# EAGLE design PICO V1.0 (EAGLE 9.6.2)
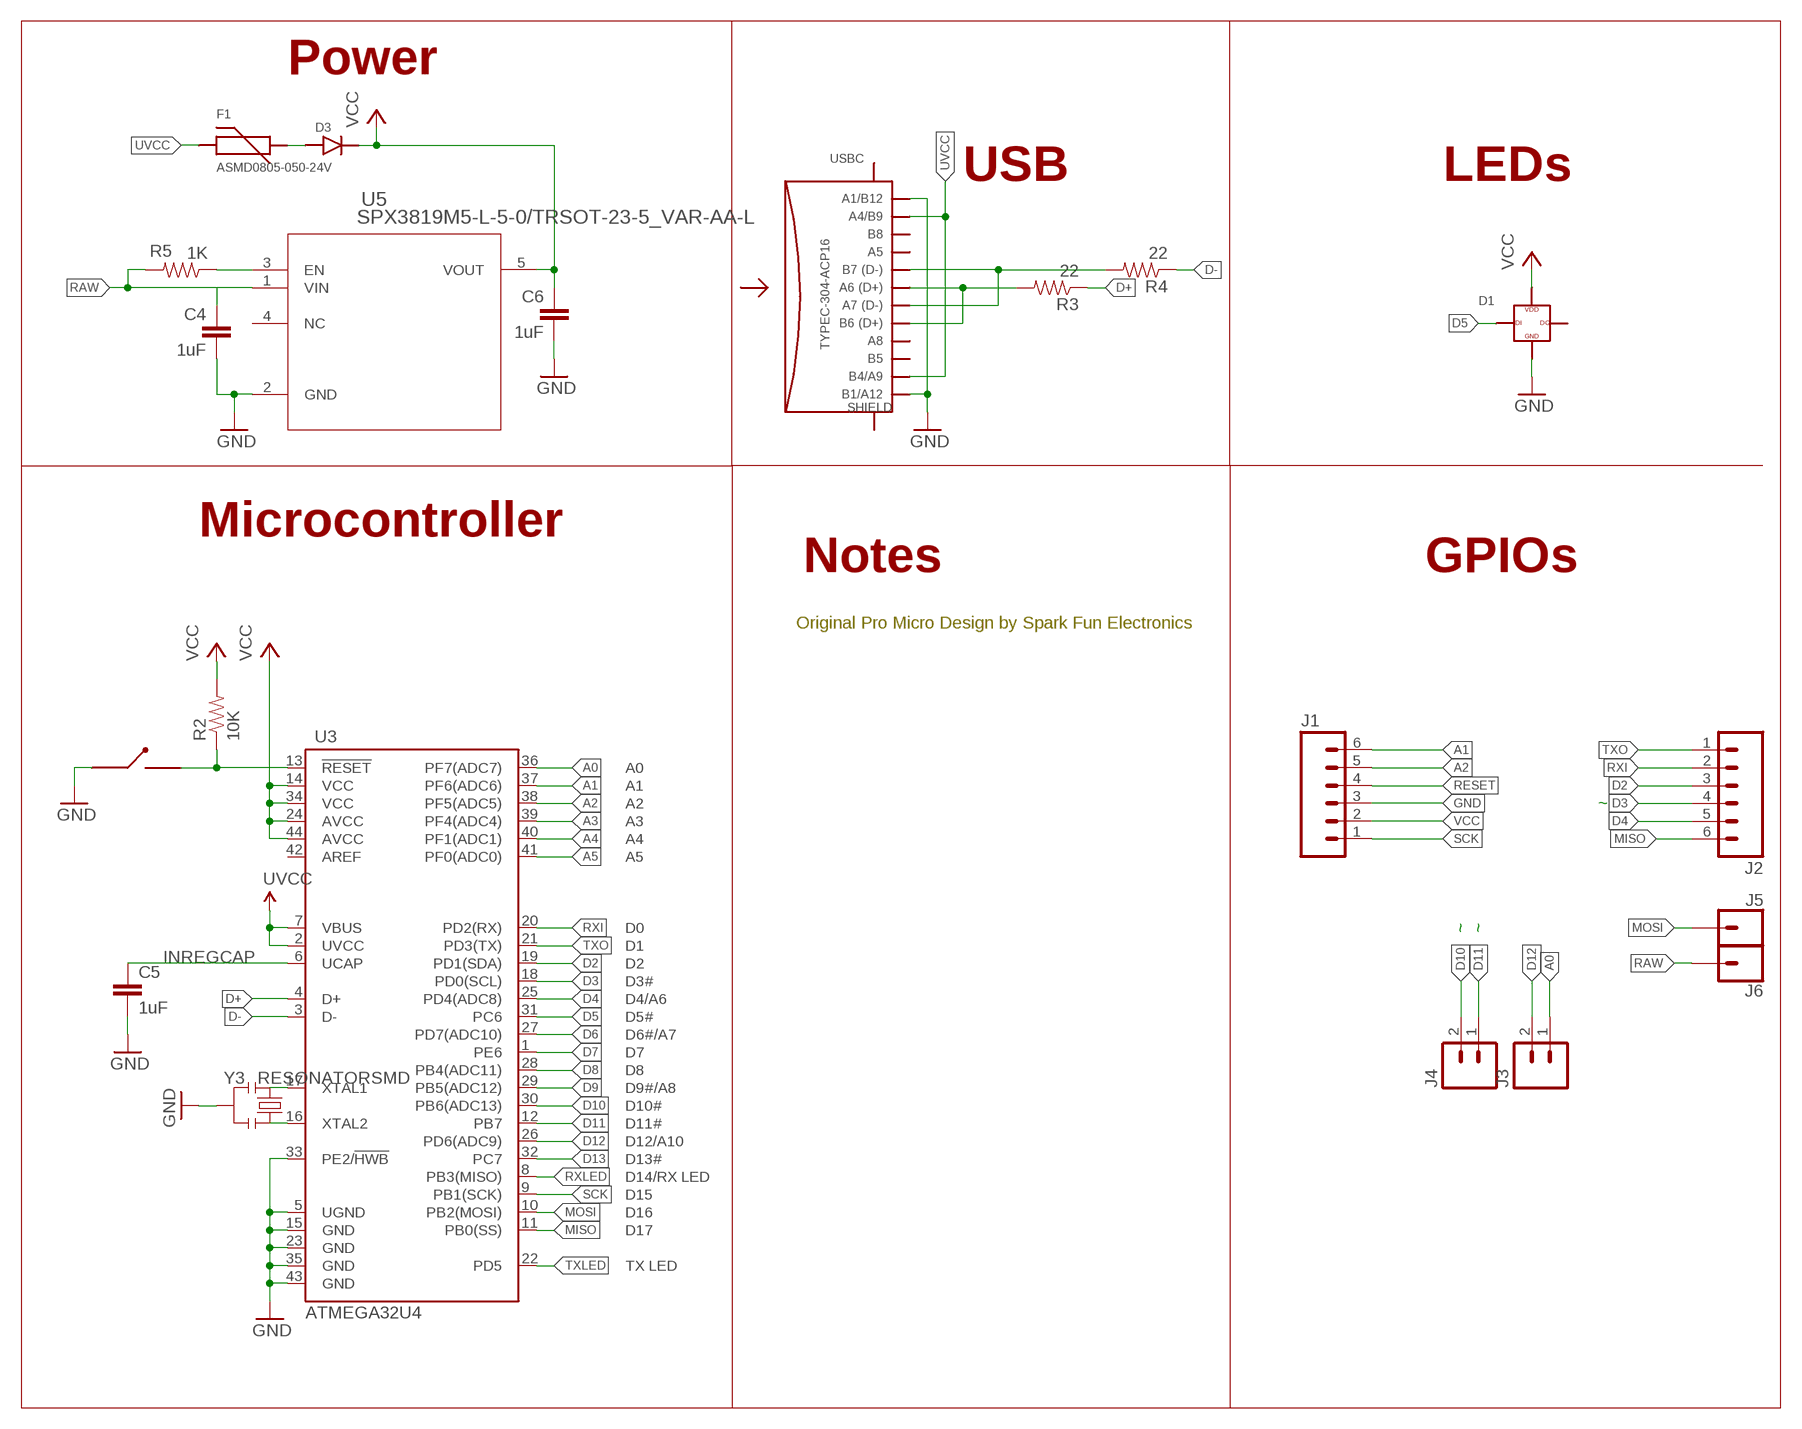
[diagram p0: schematic, sheet 1]

## Parts
C4  1uF  CAP0402-CAP  [0402-CAP]
C5  1uF  CAP0402-CAP  [0402-CAP]
C6  1uF  CAP0402-CAP  [0402-CAP]
D1  XL-1010RGBC-WS2812B  [XL-1010RGBC-WS2812B]
D3  1N4148W-TP  [1N4148W-TP]
F1  ASMD0805-050-24V  [ASMD0805-050-24V]
J1  M06SILK_FEMALE_PTH  [1X06]
J2  M06SILK_FEMALE_PTH  [1X06]
J3  M02PTH  [1X02]
J4  M02PTH  [1X02]
J5  CONN_01  [1X01]
J6  CONN_01  [1X01]
R2  10K  RESISTOR0402  [0402-RES]
R3  22  RESISTOR0402  [0402-RES]
R4  22  RESISTOR0402  [0402-RES]
R5  1K  RESISTOR0402  [0402-RES]
S1  B3U-1000P  [B3U-1000P]
U3  ATMEGA32U4  ATMEGA32U4OUTFAKES  [QFN-44-NOPAD_1:1-OUTFAKES]
U5  SPX3819M5-L-5-0/TRSOT-23-5_VAR-AA-L  [TPSPX3819M5-L-5-0/3]
USBC  TYPEC-304-ACP16  [TYPEC-304-ACP16]
Y3  RESONATORSMD  [RESONATOR-SMD]

## Nets
A0: J3.1 U3.36(PF7(ADC7))
A1: J1.6 U3.37(PF6(ADC6))
A2: J1.5 U3.38(PF5(ADC5))
A3: U3.39(PF4(ADC4))
A4: U3.40(PF1(ADC1))
A5: U3.41(PF0(ADC0))
D2: J2.3 U3.19(PD1(SDA))
D3: J2.4 U3.18(PD0(SCL))
D4: J2.5 U3.25(PD4(ADC8))
D5: D1.4 U3.31(PC6)
D6: U3.27(PD7(ADC10))
D7: U3.1(PE6)
D8: U3.28(PB4(ADC11))
D9: U3.29(PB5(ADC12))
D10: J4.2 U3.30(PB6(ADC13))
D11: J4.1 U3.12(PB7)
D12: J3.2 U3.26(PD6(ADC9))
D13: U3.32(PC7)
D+: R3.1 U3.4(D+)
D-: R4.1 U3.3(D-)
GND [vcc]: C4.2 C5.2 C6.2 D1.3 J1.3 S1.1 U3.5(UGND) U3.15(GND) U3.23(GND) U3.33(PE2/!HWB) U3.35(GND) U3.43(GND) U5.2(GND) USBC.A1/B12 USBC.B1/A12 Y3.2
INREGCAP: C5.1 U3.6(UCAP)
MISO: J2.6 U3.11(PB0(SS))
MOSI: J5.1 U3.10(PB2(MOSI))
N$1: U3.16(XTAL2) Y3.3
N$2: U3.17(XTAL1) Y3.1
N$4: R5.1 U5.3(EN)
N$5: D3.1 F1.2
N$7: R3.2 USBC.A6 USBC.B6
N$9: R4.2 USBC.A7 USBC.B7
RAW [vcc]: C4.1 J6.1 R5.2 U5.1(VIN)
RESET: J1.4 R2.1 S1.2 U3.13(!RESET)
RXI: J2.2 U3.20(PD2(RX))
RXLED: U3.8(PB3(MISO))
SCK: J1.1 U3.9(PB1(SCK))
TXLED: U3.22(PD5)
TXO: J2.1 U3.21(PD3(TX))
UVCC: F1.1 U3.2(UVCC) U3.7(VBUS) USBC.A4/B9 USBC.B4/A9
VCC: C6.1 D1.2 D3.2 J1.2 R2.2 U3.14(VCC) U3.24(AVCC) U3.34(VCC) U3.44(AVCC) U5.5(VOUT)
Unconnected: D1.1 U3.42(AREF) U5.4(NC) USBC.A5 USBC.A8 USBC.B5 USBC.B8 USBC.P$1(SHIELD1) USBC.P$2(SHIELD1) USBC.P$3(SHIELD2) USBC.P$4(SHIELD2)

## Notes on the sheet
- Power
- USB | LEDs
- Microcontroller
- Notes | GPIOs
- Original Pro Micro Design by Spark Fun Electronics
- ~
- ~ | ~

## Library data of the parts
C4-C6 = SparkFun-Capacitors:CAP: Capacitor Standard 0603 ceramic capacitor, and 0.1" leaded capacitor.
D1 = XL-1010RGBC-WS2812B:XL-1010RGBC-WS2812B
D3 = 1N4148W-TP:1N4148W-TP
F1 = ASMD0805-050-24V:ASMD0805-050-24V
J1 J2 = SparkFun-Connectors:M06: Header 6 Standard 6-pin 0.1" header. Use with straight break away headers (SKU : PRT-00116), right angle break away headers (PRT-00553), swiss pins (PRT-00743), machine pins (PRT-00117), and female headers (PRT-00115). Molex polarized connector foot print use with SKU : PRT-08094 with associated crimp pins and housings. NOTES ON THE VARIANTS LOCK and LOCK_LONGPADS... This footprint was designed to help hold the alignment of a through-hole component (i.e. 6-pin header) while soldering it into place. You may notice that each hole has been shifted either up or down by 0.005 of an inch from it's more standard position (which is a perfectly straight line). This slight alteration caused the pins (the squares in the middle) to touch the edges of the holes. Because they are alternating, it causes a "brace" to hold the component in place. 0.005 has proven to be the perfect amount of "off-center" position when using our standard breakaway headers. Although looks a little odd when you look at the bare footprint, once you have a header in there, the alteration is very hard to notice. Also,if you push a header all the way into place, it is covered up entirely on the bottom side. This idea of altering the position of holes to aid alignment will be further integrated into the Sparkfun Library for other footprints. It can help hold any component with 3 or more connection pins.; PROD_ID: CONN-08437
J3 J4 = SparkFun-Connectors:M02: Standard 2-pin 0.1" header. Use with - straight break away headers ( PRT-00116) - right angle break away headers (PRT-00553) - swiss pins (PRT-00743) - machine pins (PRT-00117) - female headers (PRT-00115) Molex polarized connector foot print use with: PRT-08233 with associated crimp pins and housings. 2.54_SCREWTERM for use with PRT-10571. 3.5mm Screw Terminal footprints for PRT-08084 5mm Screw Terminal footprints for use with PRT-08432
J5 J6 = SparkFun-Connectors:CONN_01: Single connection point. Often used as Generic Header-pin footprint for 0.1 inch spaced/style header connections On any of the 0.1 inch spaced packages, you can populate with these: Break Away Headers - Straight <https://www.sparkfun.com/products/116> (PRT-00116) Break Away Male Headers - Right Angle <https://www.sparkfun.com/products/553> (PRT-00553) Female Headers <https://www.sparkfun.com/products/115> (PRT-00115) Break Away Headers - Machine Pin <https://www.sparkfun.com/products/117> (PRT-00117) Break Away Female Headers - Swiss Machine Pin <https://www.sparkfun.com/products/743> (PRT-00743) This device is also useful as a general connection point to wire up your design to another part of your project. Our various solder wires solder well into these plated through hole pads. Hook-Up Wire - Assortment (Stranded, 22 AWG) <https://www.sparkfun.com/products/11375> (PRT-11375) Hook-Up Wire - Assortment (Solid Core, 22 AWG) <https://www.sparkfun.com/products/11367> (PRT-11367) View the entire wire category on our website here <https://www.sparkfun.com/categories/141> Special notes: SMTSO-256-ET is a "flush mount" nut for a 4-40 screw. We mostly use this on specialty testbeds; it is a nice way to connect hardware to your PCB at an adjustable hieght. Also note, the SNAP packages are for using a snappable style connector. We sell a baggie of snaps and they are also used on two LilyPad designs: Snap Assortment - 30 pack (male and female) <https://www.sparkfun.com/products/11347> (DEV-11347) LilyPad Arduino SimpleSnap <https://www.sparkfun.com/products/10941> (DEV-10941) LilyPad SimpleSnap Protoboard <https://www.sparkfun.com/products/10940> (DEV-10940)
R2-R5 = SparkFun-Resistors:RESISTOR: Resistor Basic schematic elements and footprints for 0603, 1206, and PTH resistors.
S1 = B3U-1000P:B3U-1000P
U3 = Testing:ATMEGA32U4: Atmel 44-pin 8-bit Microcontroller with 32KBytes of ISP Flash and USB Controller
U5 = TPSPX3819M5-L-5-0:SPX3819M5-L-5-0/TR; COPYRIGHT: Copyright (C) 2024 Ultra Librarian. All rights reserved.; MANUFACTURER_PART_NUMBER: SPX3819M5-L-5-0/TR; MFR_NAME: MaxLinear
USBC = TYPEC-304-ACP16:TYPEC-304-ACP16
Y3 = SparkFun:RESONATOR: Resonator Small SMD resonator. This is the itty bitty 10/20MHz resonators with built in caps. CSTCE10M0G55 and CSTCE20M0V53. Footprint has been reviewed closely but hasn't been tested yet.

## Net classes
0 default: width 0.152 mm, drill 0.15 mm, clearance 0.152 mm

## Board
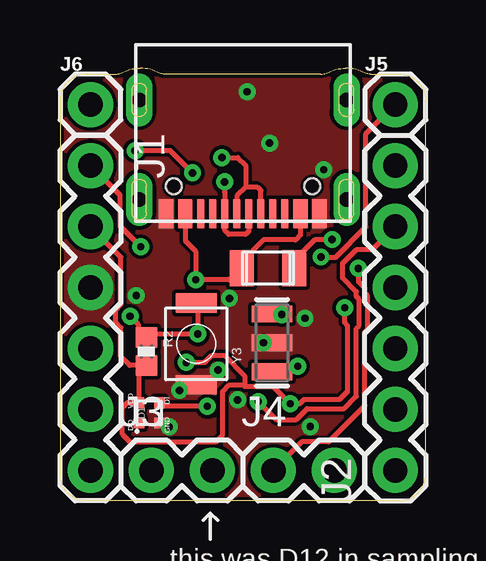
[diagram p1: board, top side]
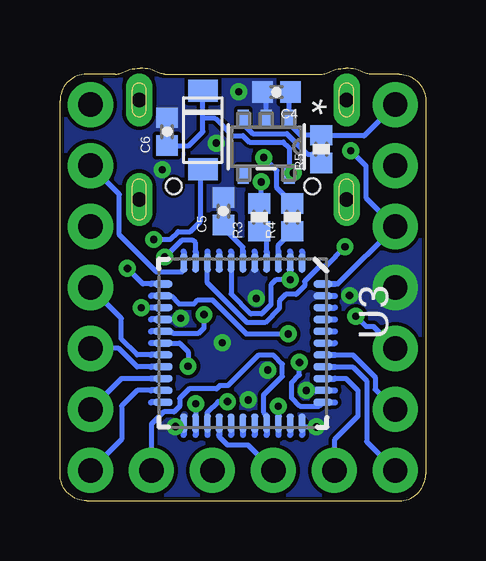
[diagram p2: board, bottom side, seen from below]

Size 15.24 x 18.02 mm. Coordinates in mm from the lower left corner, seen from the top.
Outline: 14.13,17.78 arc-90 15.24,16.67 15.24,1.11 arc-90 14.13,0 1.11,0 arc-90 0,1.11 0,16.67 arc-90 1.11,17.78 2.3,17.78 arc28 2.62,17.86 arc-31 3.33,18.02 arc-31 4.05,17.86 arc28 4.37,17.78 10.87,17.78 arc28 11.19,17.86 arc-31 11.91,18.02 arc-31 12.62,17.86 arc28 12.94,17.78 14.13,17.78
Copper layers (1*16): Top 0.035mm / dielectric 1.5mm / Bottom 0.035mm
Design rules "default *": minimum track width 8mil, minimum drill 0.3mm, track to track 6mil, track to pad 6mil, pad to pad 6mil, via to via 6mil, smd to smd 6mil, copper to edge 6mil, drill to drill 6mil, minimum pad ring 10mil, minimum via ring 8mil, stop-mask expansion 0mil, vias tented up to drill 12mil, thermal gap 10mil

### Footprints (pad centres in the part's own frame; a part is rotated, then mirrored left to right if it is on the bottom)
0402-CAP = smd 0.85 x 0.9: 1 -0.58,0; 2 0.58,0
XL-1010RGBC-WS2812B = smd 0.45 x 0.45: 1 -0.425,0.425; 2 0.425,0.425; 3 -0.425,-0.425; 4 0.425,-0.425
1N4148W-TP = smd 0.91 x 1.22: 1 -1.635,0; 2 1.635,0
ASMD0805-050-24V = smd 1 x 1.5: 1 -1.1,0; 2 1.1,0
1X06 = drill 1.016 pad 1.88: 1 0,0; 2 2.54,0; 3 5.08,0; 4 7.62,0; 5 10.16,0; 6 12.7,0
1X02 = drill 1.016 pad 1.88: 1 0,0; 2 2.54,0
1X01 = drill 1.016 pad 1.88: 1 0,0
0402-RES = smd 0.85 x 0.9: 1 -0.58,0; 2 0.58,0
B3U-1000P = smd 0.8 x 1.7: 1 1.7,0; 2 -1.7,0
QFN-44-NOPAD_1:1-OUTFAKES = smd 0.8 x 0.3: 1 -3.337,2.465; 2 -3.337,1.972; 3 -3.337,1.479; 4 -3.337,0.986; 5 -3.337,0.493; 6 -3.337,0; 7 -3.337,-0.493; 8 -3.337,-0.986; 9 -3.337,-1.479; 10 -3.337,-1.972; 11 -3.337,-2.465; 23 3.337,-2.465; 24 3.337,-1.972; 25 3.337,-1.479; 26 3.337,-0.986; 27 3.337,-0.493; 28 3.337,0; 29 3.337,0.493; 30 3.337,0.986; 31 3.337,1.479; 32 3.337,1.972; 33 3.337,2.465 | smd 0.3 x 0.8: 12 -2.465,-3.337; 13 -1.972,-3.337; 14 -1.479,-3.337; 15 -0.986,-3.337; 16 -0.493,-3.337; 17 0,-3.337; 18 0.493,-3.337; 19 0.986,-3.337; 20 1.479,-3.337; 21 1.972,-3.337; 22 2.465,-3.337; 34 2.465,3.337; 35 1.972,3.337; 36 1.479,3.337; 37 0.986,3.337; 38 0.493,3.337; 39 0,3.337; 40 -0.493,3.337; 41 -0.986,3.337; 42 -1.479,3.337; 43 -1.972,3.337; 44 -2.465,3.337
TPSPX3819M5-L-5-0/3 = smd 0.747 x 0.458: 1 -1.174,0.95; 2 -1.174,0; 3 -1.174,-0.95; 4 1.174,-0.95; 5 1.174,0.95
TYPEC-304-ACP16 = smd 0.6 x 1.2: A1/B12 -3.2,3.375; A4/B9 -2.4,3.375; B1/A12 3.2,3.375; B4/A9 2.4,3.375 | smd 0.3 x 1.2: A5 -1.25,3.375; A6 -0.25,3.375; A7 0.25,3.375; A8 1.25,3.375; B5 1.75,3.375; B6 0.75,3.375; B7 -0.75,3.375; B8 -1.75,3.375 | drill 0.6 pad 1.05 long: P$1 -4.32,2.775; P$2 4.32,2.775 | drill 0.6 pad 0.95 long: P$3 -4.32,-1.375; P$4 4.32,-1.375 | hole 0.65: -2.89,2.225; 2.89,2.225
RESONATOR-SMD = smd 0.7 x 1.7: 1 -1.2,0; 2 0,0; 3 1.2,0

### Placement (x,y rotation side)
C4  6.22,17.03 180 bottom
C5  8.43,12.07 90 bottom
C6  10.78,15.38 90 bottom
D1  3.72,3.67 90 top
D3  9.29,15.45 90 bottom
F1  8.67,9.7 0 top
J1  1.27,13.97 270 top
J2  13.97,1.27 90 top
J3  3.81,1.27 0 top
J4  8.89,1.27 0 top
J5  13.97,16.51 0 top
J6  1.27,16.51 0 top
R2  3.6,6.22 270 top
R3  6.94,11.81 90 bottom
R4  5.56,11.81 90 bottom
R5  4.35,14.65 90 bottom
S1  5.68,6.54 270 top
U3  7.62,6.57 270 bottom
U5  6.65,14.75 270 bottom
USBC  7.62,15.33 180 top
Y3  8.84,6.58 90 top

### Tracks (layer width: path | path; a pad name or v marks a point on that pad's centre or on a via)
A0
  Bottom 0.203: U3.36 3.31,5.09 2.82,4.6 2.82,3.53 3.81,2.54 J3.1
A1
  Bottom 0.203: U3.37 3.05,5.59 2.46,5 2.46,2.46 J1.6
A2
  Bottom 0.203: U3.38 3.6,6.08 3.04,6.08 2.11,5.15 2.11,4.65 J1.5
D2
  Bottom 0.203: U3.19 12.03,5.59 12.79,6.35 J2.3
D3
  Bottom 0.203: U3.18 12.02,6.08 12.68,6.74 12.68,7.6 J2.4
D4  (via drill 0.3)
  Top 0.203: v8.26,4.14 9.02,3.38 9.84,3.38 10.3,3.84 11.84,3.84 12.34,4.35 12.34,7.18 12.47,7.3 12.47,8.39 12.34,8.52 12.34,8.72 11.78,9.29 11.78,9.91 12.34,10.46 13,10.46 J2.5
  Bottom 0.203: U3.25 9.1,3.69 8.65,4.14 v8.26,4.14
D5  (via drill 0.3)
  Top 0.203: v6.14,3.94 4.3,3.94 D1.4
  Bottom 0.203: U3.31 | U3.31 v6.14,3.94
D10
  Bottom 0.203: J4.2 11.43,3.19 10.92,3.7 10.49,3.7 10.26,3.93 10.26,4.27 9.86,4.67 8.72,4.67 8.59,4.8 8.24,4.8 6.99,6.06 6.33,6.06 5.98,5.7 5.98,5.18 6.76,4.4 6.76,3.7 6.63,3.56 U3.30
D11  (via drill 0.3)
  Top 0.203: v12.43,9.68 12.43,9.14 12.7,8.87 12.7,8.66 12.82,8.54 12.82,7.16 12.7,7.04 12.7,3.97 11.19,2.46 10.08,2.46 J4.1
  Bottom 0.203: v12.43,9.68 11.78,9.04 U3.12
D12
  Bottom 0.203: U3.26 8.61,2.67 8.27,2.33 7.41,2.33 J3.2
D+
  Bottom 0.203: U3.4 6.63,10.93 R3.1
D-
  Bottom 0.203: U3.3 6.14,10.65 R4.1
GND  (via drill 0.3)
  Top 0.203: Y3.2 v8.48,6.58 v8.48,6.59 | D1.3 4.39,3.24 v4.56,3.08
  Bottom 0.203: U5.2 6.64,16.87 C4.2 | U3.23 10.29,3.24 v10.43,3.1 | U3.33 5.16,3.08 v4.56,3.08
  other vias: 10.21,7.6 6.59,5.45 10.99,13.8 8.73,14.91 7.79,17.05 3.17,8.56 7.06,8.44 7.4,4.2 4.98,4.6
  pour Bottom (no thermals): 1.11,17.78 14.13,17.78 arc-90 15.24,16.67 15.24,1.11 arc-90 14.13,0 1.11,0 arc-90 0,1.11 0,16.67 arc-90
  pour Top (no thermals): 1.11,17.78 14.13,17.78 arc-90 15.24,16.67 15.24,1.11 arc-90 14.13,0 1.11,0 arc-90 0,1.11 0,16.67 arc-90
INREGCAP
  Bottom 0.203: U3.6 7.62,10.57 8.43,11.38 C5.1
MISO
  Bottom 0.203: U3.11 10.09,9.62 10.16,9.54 11.23,9.54 12.77,11.09 12.77,12.77 J2.6
MOSI  (via drill 0.3)
  Top 0.203: v10.87,10.16 11.49,10.16 12.75,11.41 12.75,15.29 J5.1
  Bottom 0.203: U3.10 9.59,10.75 9.7,10.86 10.18,10.86 v10.87,10.16
N$1  (via drill 0.3)
  Top 0.203: Y3.3 8.86,7.76 v9.24,7.76
  Bottom 0.203: U3.16 10.62,7.07 10.54,6.99 9.46,6.99 9.24,7.21 v9.24,7.76
N$2  (via drill 0.3)
  Top 0.203: Y3.1 9.05,5.6 v9.91,5.6
  Bottom 0.203: U3.17 10.26,6.57 9.91,6.22 v9.91,5.6
N$4
  Bottom 0.203: U5.3 7.59,15.69 7.2,15.3 5.79,15.3 4.93,14.45 4.73,14.45 R5.1
N$5  (via drill 0.3)
  Top 0.203: F1.2 9.91,9.85 9.91,10.16 10.64,10.89 v11.34,10.89
  Bottom 0.203: v11.34,10.89 10.65,10.89 10.32,11.21 9.82,11.21 9.38,11.65 9.38,13.72 D3.1
N$7  (via drill 0.3)
  Top 0.203: USBC.A6 7.87,11.24 7.73,11.1 7.03,11.1 6.87,11.26 USBC.B6 6.87,12.85 6.86,12.86 v6.86,13.29
  Bottom 0.203: R3.2 6.86,12.47 v6.86,13.29
N$9  (via drill 0.3)
  Top 0.203: USBC.B7 8.37,12.93 8.24,13.06 7.73,13.06 | USBC.A7 7.37,12.7 7.73,13.06 | v6.75,14.3 7.41,14.3 7.73,13.99 7.73,13.06
  Bottom 0.203: R4.2 6.21,13.04 6.21,13.76 v6.75,14.3
RAW
  Bottom 0.203: J6.1 2.57,15.21 4.33,15.21 R5.2 5.21,15.23 5.7,15.71 U5.1 5.7,16.98 C4.1
RESET  (via drill 0.3)
  Top 0.203: S1.2 5.74,8.19 v5.74,6.96 3.75,6.96 R2.1 3.53,6.8 3.26,7.07 3.26,7.36 v2.92,7.7
  Bottom 0.203: v5.74,6.96 7.48,6.96 8.89,8.37 9.49,8.37 9.65,8.21 10.28,8.21 10.62,8.54 U3.13 | v2.92,7.7 2.49,7.26 2.19,7.26 J1.4
RXI
  Bottom 0.203: U3.20 12.69,5.09 J2.2
SCK  (via drill 0.3)
  Top 0.203: J1.1 2.49,12.75 2.49,11.46 v3.37,10.59
  Bottom 0.203: v3.37,10.59 4.17,9.78 4.42,9.78 5.04,9.15 5.04,8.96 5.4,8.6 5.83,8.6 6.1,8.33 6.1,8.03 6.7,7.43 7.13,7.43 7.45,7.43 9.1,9.08 U3.9
TXO
  Bottom 0.203: U3.21 12.02,4.6 12.67,3.95 12.67,2.57 J2.1
UVCC  (via drill 0.3)
  Top 0.203: USBC.A4/B9 10.02,11.08 9.81,10.88 8.48,10.88 7.57,9.97 F1.1 7.07,9.21 v5.65,9.21 5.65,10.4 5.22,10.83 USBC.B4/A9
  Bottom 0.203: U3.2 v5.65,9.21 6.25,9.21 6.46,9 6.46,8.17 6.83,7.79 7.29,7.79 8.11,8.62 U3.7
VCC  (via drill 0.3)
  Top 0.203: J1.2 2.54,10.16 2.54,8.17 2.31,7.95 2.31,7.45 2.54,7.22 2.54,6 2.9,5.64 R2.2 3.29,5.33 D1.2 2.81,4.09 2.6,3.89 2.6,2.78 2.91,2.47 6.51,2.47 6.78,2.74 6.78,4.55 7.06,4.83 7.69,4.83 | v5.52,13.66 4.6,14.59 v3.13,14.59 | v11.86,8.05 11.86,7.43 11.99,7.3 11.99,4.57 11.64,4.22 10.16,4.22 10,4.05 v9.59,4.05 8.87,4.77 7.69,4.77 7.69,4.83 | v5.26,5.77 6.04,5.77 6.33,6.06 6.84,6.06 7.69,5.2 7.69,4.83
  Bottom 0.203: v9.59,4.05 U3.24 | U3.44 3.66,9.04 J1.2 1.29,11.43 2.49,12.64 2.49,13.95 v3.13,14.59 | C6.1 9.87,14.8 9.29,15.38 9.29,15.94 | 9.29,15.94 D3.2 | 9.29,15.94 8.77,15.94 8.05,15.22 7.62,15.22 7.35,14.95 5.93,14.95 5.7,14.71 U5.5 5.6,13.58 v5.52,13.66 | U3.14 v11.86,8.05 | U3.34 4.44,3.95 5.25,3.95 5.59,4.29 5.59,4.92 5.26,5.25 v5.26,5.77

### Text on the board
tPlace: this was D12 in sampling round
tTest: DI | DO | vcclabs.com